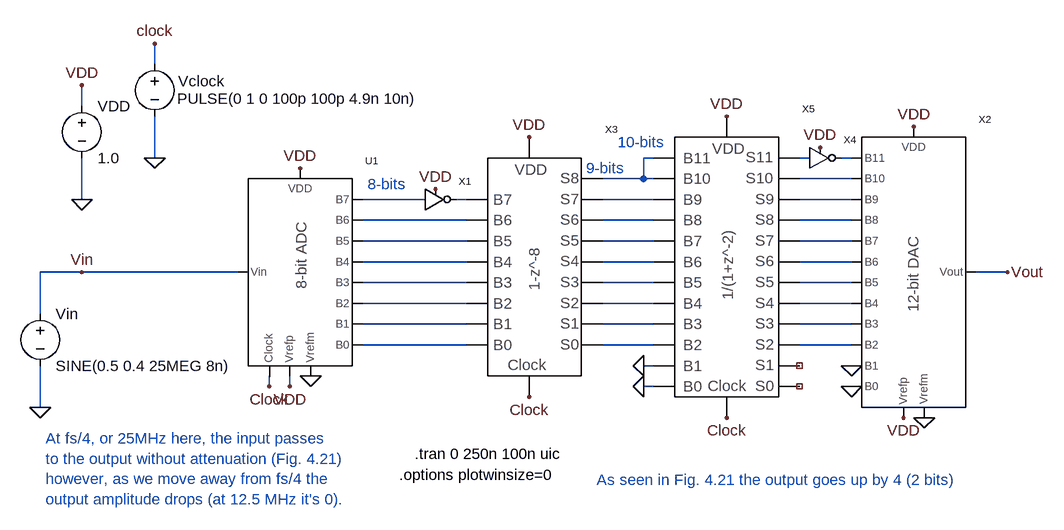
[diagram p0: schematic _Fig4_25_MSD.asc]
_Fig4_25_MSD.asc, the LTspice schematic file:
Version 4
SHEET 1 2740 696
WIRE 640 -864 640 -896
WIRE 528 -800 528 -832
WIRE 640 -720 640 -784
WIRE 1408 -720 1392 -720
WIRE 1648 -720 1632 -720
WIRE 1712 -720 1696 -720
WIRE 1392 -688 1392 -720
WIRE 1392 -688 1328 -688
WIRE 1408 -688 1392 -688
WIRE 1712 -688 1632 -688
WIRE 528 -656 528 -720
WIRE 1056 -656 960 -656
WIRE 1120 -656 1104 -656
WIRE 1408 -656 1328 -656
WIRE 1712 -656 1632 -656
WIRE 1120 -624 960 -624
WIRE 1408 -624 1328 -624
WIRE 1712 -624 1632 -624
WIRE 1120 -592 960 -592
WIRE 1408 -592 1328 -592
WIRE 1712 -592 1632 -592
WIRE 1120 -560 960 -560
WIRE 1408 -560 1328 -560
WIRE 1712 -560 1632 -560
WIRE 528 -544 464 -544
WIRE 768 -544 528 -544
WIRE 1952 -544 1904 -544
WIRE 1120 -528 960 -528
WIRE 1408 -528 1328 -528
WIRE 1712 -528 1632 -528
WIRE 1120 -496 960 -496
WIRE 1408 -496 1328 -496
WIRE 1712 -496 1632 -496
WIRE 464 -480 464 -544
WIRE 1120 -464 960 -464
WIRE 1408 -464 1328 -464
WIRE 1712 -464 1632 -464
WIRE 1120 -432 960 -432
WIRE 1408 -432 1328 -432
WIRE 1712 -432 1632 -432
WIRE 1408 -400 1392 -400
WIRE 816 -368 816 -384
WIRE 848 -368 848 -384
WIRE 1408 -368 1392 -368
WIRE 464 -336 464 -400
FLAG 464 -336 0
FLAG 528 -544 Vin
FLAG 640 -720 0
FLAG 640 -896 clock
FLAG 528 -656 0
FLAG 528 -832 VDD
FLAG 1952 -544 Vout
FLAG 1808 -768 VDD
FLAG 1824 -320 0
FLAG 1520 -784 VDD
FLAG 864 -704 VDD
FLAG 880 -384 0
FLAG 816 -368 Clock
FLAG 848 -368 VDD
FLAG 1520 -320 Clock
FLAG 1792 -320 VDD
FLAG 1216 -352 Clock
FLAG 1216 -752 VDD
FLAG 1072 -672 VDD
FLAG 1392 -400 0
FLAG 1392 -368 0
FLAG 1664 -736 VDD
FLAG 1712 -368 0
FLAG 1712 -400 0
SYMBOL voltage 464 -496 R0
WINDOW 123 0 0 Left 0
WINDOW 39 0 0 Left 0
SYMATTR InstName Vin
SYMATTR Value SINE(0.5 0.4 25MEG 8n)
SYMBOL voltage 640 -880 R0
WINDOW 0 36 42 Left 0
WINDOW 3 35 69 Left 0
WINDOW 123 0 0 Left 0
WINDOW 39 0 0 Left 0
SYMATTR InstName Vclock
SYMATTR Value PULSE(0 1 0 100p 100p 4.9n 10n)
SYMBOL voltage 528 -816 R0
WINDOW 123 0 0 Left 0
WINDOW 39 0 0 Left 0
SYMATTR InstName VDD
SYMATTR Value 1.0
SYMBOL Ideal_8_bit_ADC 784 -400 R0
SYMATTR InstName U1
SYMBOL Ideal_12_bit_DAC 1728 -336 R0
SYMATTR InstName X2
SYMBOL 8_bit_comb_K_8 1152 -384 R0
SYMATTR InstName X3
SYMBOL fsby4_resonator_12bit 1440 -352 R0
SYMATTR InstName X5
SYMBOL inverter 1056 -656 R0
SYMATTR InstName X1
SYMBOL inverter 1648 -720 R0
SYMATTR InstName X4
TEXT 1040 -264 Left 0 !.tran 0 250n 100n uic
TEXT 472 -288 Left 0 ;At fs/4, or 25MHz here, the input passes\nto the output without attenuation (Fig. 4.21)\nhowever, as we move away from fs/4 the\noutput amplitude drops (at 12.5 MHz it's 0).
TEXT 1016 -232 Left 0 !.options plotwinsize=0
TEXT 1320 -224 Left 0 ;As seen in Fig. 4.21 the output goes up by 4 (2 bits)
TEXT 1304 -704 Left 0 ;9-bits
TEXT 1352 -744 Left 0 ;10-bits
TEXT 968 -680 Left 0 ;8-bits

The netlist it stands for:
* _Fig4_25_MSD.asc
Vin Vin 0 SINE(0.5 0.4 25MEG 8n)
Vclock clock 0 PULSE(0 1 0 100p 100p 4.9n 10n)
VDD VDD 0 1.0
XU1 N005 N009 N012 N015 N018 N021 N024 N027 Vin VDD 0 clock VDD Ideal_8_bit_ADC  ; pins B7 B6 B5 B4 B3 B2 B1 B0 Vin Vrefp Vrefm Clock VDD
XX2 N003 N004 N008 N011 N014 N017 N020 N023 N026 N029 0 0 Vout VDD 0 VDD Ideal_12_bit_DAC  ; pins B11 B10 B9 B8 B7 B6 B5 B4 B3 B2 B1 B0 Vout Vrefp Vrefm VDD
XX3 N027 N024 N021 N018 N015 N012 N009 N006 N028 N025 N022 N019 N016 N013 N010 N007 N001 clock VDD 8_bit_comb_K_8  ; pins B0 B1 B2 B3 B4 B5 B6 B7 S0 S1 S2 S3 S4 S5 S6 S7 S8 Clock VDD
XX5 0 0 N028 N025 N022 N019 N016 N013 N010 N007 N001 N001 NC_01 NC_02 N029 N026 N023 N020 N017 N014 N011 N008 N004 N002 clock VDD fsby4_resonator_12bit  ; pins B0 B1 B2 B3 B4 B5 B6 B7 B8 B9 B10 B11 S0 S1 S2 S3 S4 S5 S6 S7 S8 S9 S10 S11 Clock VDD
XX1 N005 N006 VDD inverter  ; pins In Out VDD
XX4 N002 N003 VDD inverter  ; pins In Out VDD
.tran 0 250n 100n uic
* At fs/4, or 25MHz here, the input passes
* to the output without attenuation (Fig. 4.21)
* however, as we move away from fs/4 the
* output amplitude drops (at 12.5 MHz it's 0).
.options plotwinsize=0
* As seen in Fig. 4.21 the output goes up by 4 (2 bits)
* 9-bits
* 10-bits
* 8-bits
.backanno
.end